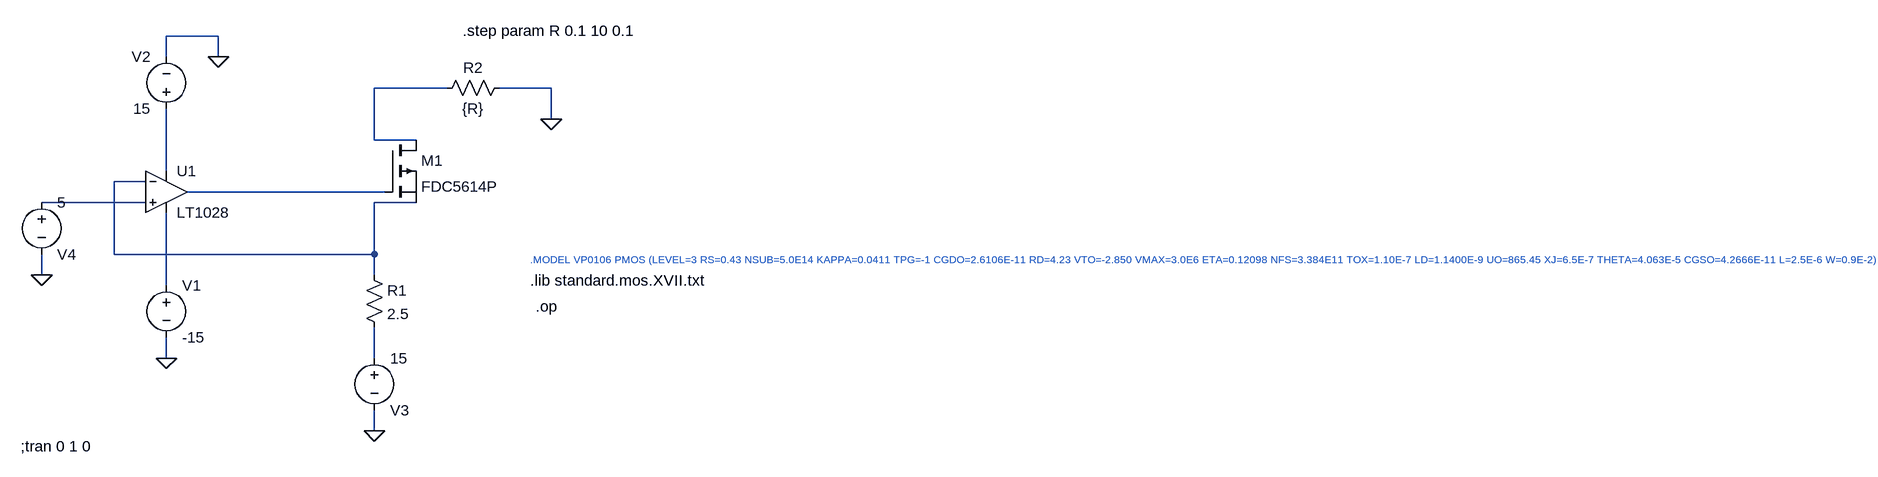
[diagram p0: schematic Draft2.asc]
Draft2.asc, the LTspice schematic file:
Version 4
SHEET 1 2400 680
WIRE -224 -208 -304 -208
WIRE -304 -176 -304 -208
WIRE -224 -176 -224 -208
WIRE 128 -128 16 -128
WIRE 288 -128 208 -128
WIRE 288 -80 288 -128
WIRE 16 -48 16 -128
WIRE 80 -48 16 -48
WIRE -304 0 -304 -96
WIRE -336 16 -384 16
WIRE 32 32 -272 32
WIRE -336 48 -496 48
WIRE 80 48 16 48
WIRE -384 128 -384 16
WIRE 16 128 16 48
WIRE 16 128 -384 128
WIRE -496 160 -496 128
WIRE 16 160 16 128
WIRE -304 176 -304 64
WIRE -304 288 -304 256
WIRE 16 288 16 240
WIRE 16 400 16 368
FLAG -304 288 0
FLAG -224 -176 0
FLAG 288 -80 0
FLAG 16 400 0
FLAG -496 160 0
SYMBOL OpAmps\\LT1028 -304 -32 R0
SYMATTR InstName U1
SYMBOL voltage -304 160 R0
WINDOW 123 0 0 Left 0
WINDOW 39 0 0 Left 0
SYMATTR InstName V1
SYMATTR Value -15
SYMBOL voltage -304 -80 R180
WINDOW 0 24 96 Left 2
WINDOW 3 24 16 Left 2
WINDOW 123 0 0 Left 0
WINDOW 39 0 0 Left 0
SYMATTR InstName V2
SYMATTR Value 15
SYMBOL res 0 144 R0
SYMATTR InstName R1
SYMATTR Value 2.5
SYMBOL res 224 -144 R90
WINDOW 0 0 56 VBottom 2
WINDOW 3 32 56 VTop 2
SYMATTR InstName R2
SYMATTR Value {R}
SYMBOL voltage 16 272 R0
WINDOW 0 24 96 Left 2
WINDOW 3 24 16 Left 2
WINDOW 123 0 0 Left 0
WINDOW 39 0 0 Left 0
SYMATTR InstName V3
SYMATTR Value 15
SYMBOL voltage -496 32 R0
WINDOW 0 24 96 Left 2
WINDOW 3 24 16 Left 2
WINDOW 123 0 0 Left 0
WINDOW 39 0 0 Left 0
SYMATTR InstName V4
SYMATTR Value 5
SYMBOL pmos 32 -48 R0
SYMATTR InstName M1
SYMATTR Value FDC5614P
TEXT 256 168 Left 2 !.lib standard.mos.XVII.txt
TEXT -528 424 Left 2 !;tran 0 1 0
TEXT 256 136 Left 1 ;.MODEL VP0106 PMOS (LEVEL=3 RS=0.43 NSUB=5.0E14 KAPPA=0.0411 TPG=-1 CGDO=2.6106E-11 RD=4.23 VTO=-2.850 VMAX=3.0E6 ETA=0.12098 NFS=3.384E11 TOX=1.10E-7 LD=1.1400E-9 UO=865.45 XJ=6.5E-7 THETA=4.063E-5 CGSO=4.2666E-11 L=2.5E-6 W=0.9E-2)
TEXT 152 -216 Left 2 !.step param R 0.1 10 0.1
TEXT 264 208 Left 2 !.op

The netlist it stands for:
* Draft2.asc
XU1 N005 N003 N002 N006 N004 LT1028  ; pins In+ In- V+ V- OUT
V1 N006 0 -15
V2 N002 0 15
R1 N003 N007 2.5
R2 0 N001 {R}
V3 N007 0 15
V4 N005 0 5
M1 N001 N004 N003 N003 FDC5614P
.model NMOS NMOS
.model PMOS PMOS
.lib standard.mos
.lib standard.mos.XVII.txt
;tran 0 1 0
* .MODEL VP0106 PMOS (LEVEL=3 RS=0.43 NSUB=5.0E14 KAPPA=0.0411 TPG=-1 CGDO=2.6106E-11 RD=4.23 VTO=-2.850 VMAX=3.0E6 ETA=0.12098 NFS=3.384E11 TOX=1.10E-7 LD=1.1400E-9 UO=865.45 XJ=6.5E-7 THETA=4.063E-5 CGSO=4.2666E-11 L=2.5E-6 W=0.9E-2)
.step param R 0.1 10 0.1
.op
.lib LTC.lib
.backanno
.end

* Results of the author's LTspice run, read from the files saved beside the schematic
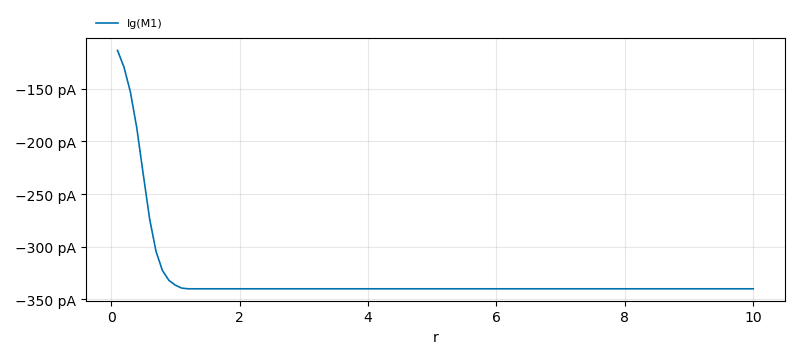
[diagram p1: Operating Point of Draft2.asc, plotted from the saved traces]
* Operating Point, 1 run:
*   Ig(M1): -113.6 pA at r=100 m, -340 pA at r=10 , min -340 pA, max -113.6 pA
* From the log:
*   Semiconductor Device Operating Points:
*                           --- Diodes ---
*   Name:    d:u1:2      d:u1:7      d:u1:6      d:u1:1      d:u1:5
*   Model:   u1:din       u1:dp       u1:y        u1:y        u1:x
*   Id:     -7.17e-20    6.60e-03   -5.38e-22    5.38e-22   -1.72e-10
*   Vd:     -7.16e-08    3.00e+01   -5.37e-10    5.37e-10   -1.71e+01
*   Req:     1.00e-12    1.00e-03    1.00e-12    1.00e-12    1.00e-11
*   CAP:     0.00e+00    0.00e+00    0.00e+00    0.00e+00    0.00e+00
*   Name:    d:u1:4
*   Model:    u1:x
*   Id:     -1.29e-10
*   Vd:     -1.29e+01
*   Req:     1.00e-11
*   CAP:     0.00e+00
*                           --- VDMOSFET Transistors ---
*   Name:          m1        m:u1:2      m:u1:1
*   Model:      fdc5614p      u1:p        u1:n
*   Id:         -4.00e+00   -8.00e-04    8.00e-04
*   Vgs:        -2.85e+00    5.37e-10    5.37e-10
*   Vds:        -4.60e+00   -1.71e+01    1.29e+01
*   Vth:        -1.85e+00    2.00e-01   -2.00e-01
*   Gm:          8.34e+00    8.00e-03    8.00e-03
*   Gds:         7.35e-02    0.00e+00    0.00e+00
*   Cgs:         9.60e-10    0.00e+00    0.00e+00
*   Cgd:         1.14e-10    0.00e+00    0.00e+00
*   Cbody:       4.06e-10    0.00e+00    0.00e+00